# Altium schematic sheet Main.SchDoc
size A2; SheetNumber: 1; SheetTotal: 1
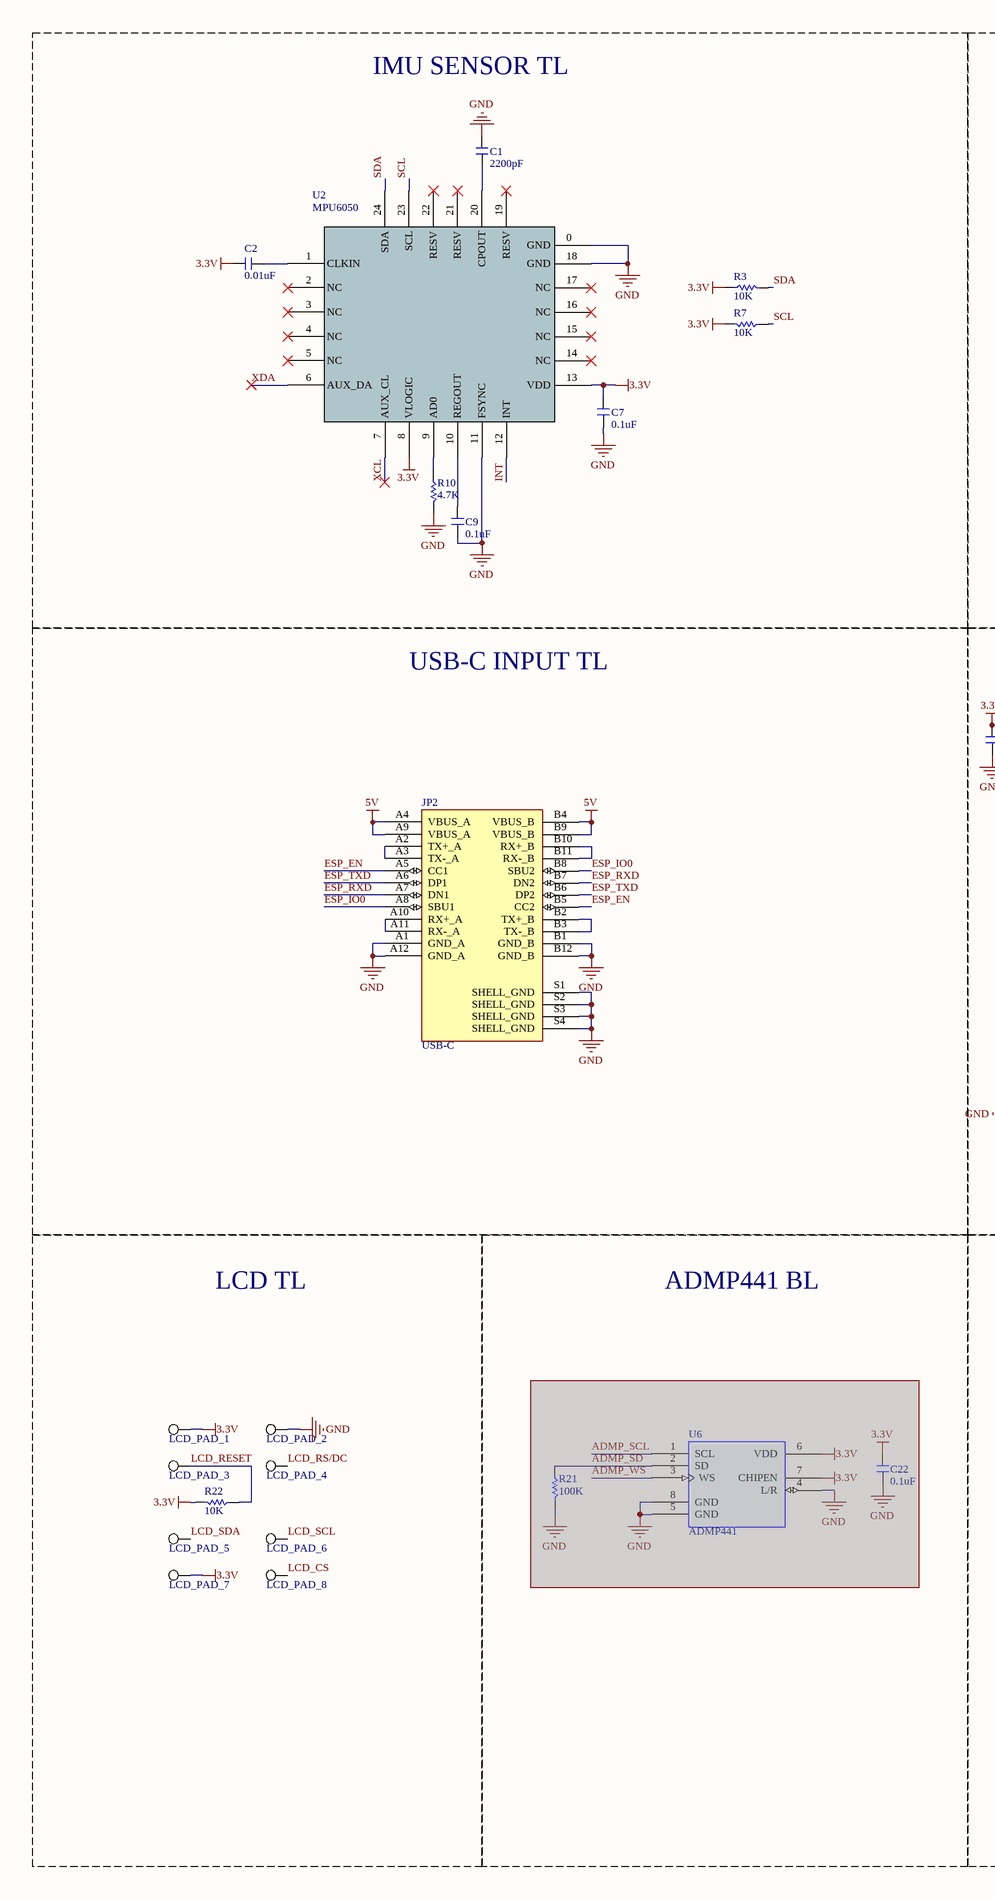
[diagram p0: Main.SchDoc, left]
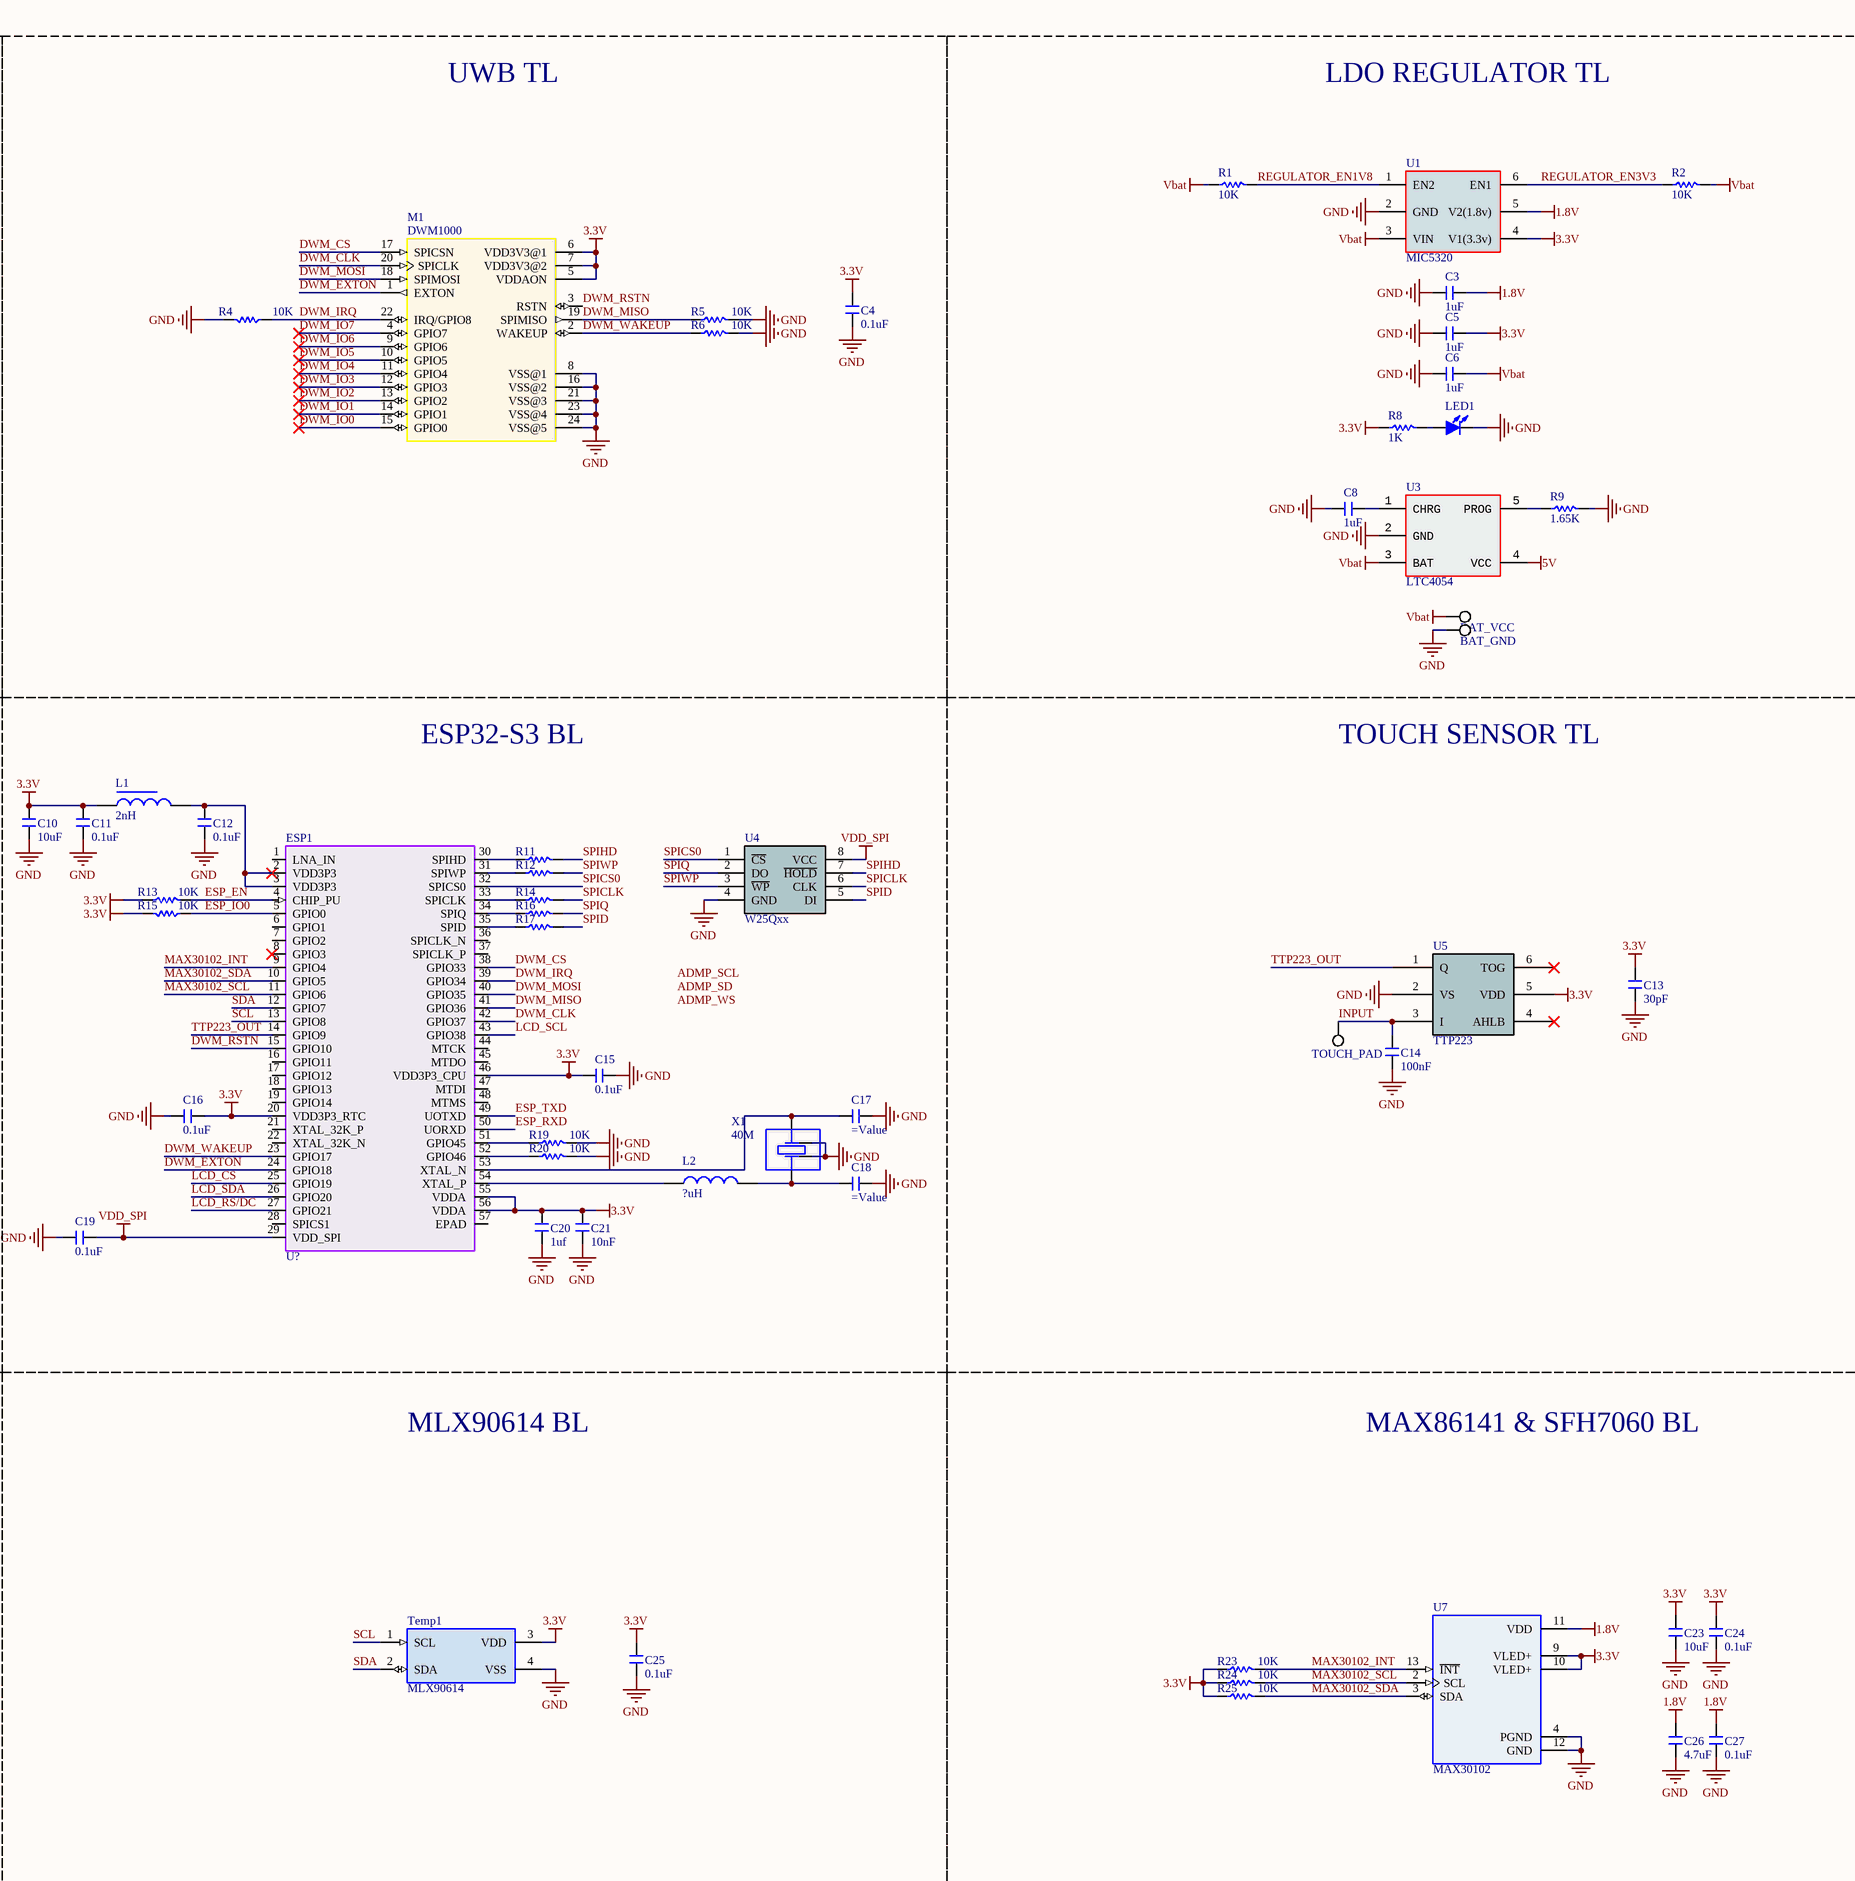
[diagram p1: Main.SchDoc, right]

## Parts
BAT_GND  Test Point Pad  [TP07SQ]  (value not drawn)
BAT_VCC  Test Point Pad  [TP07SQ]  (value not drawn)
C1  2200pF  [C 0402]
C2  0.01uF  [C 0402]
C3  1uF  [C 0603]
C4  0.1uF  [C 0402]
C5  1uF  [C 0603]
C6  1uF  [C 0603]
C7  0.1uF  [C 0402]
C8  1uF  [C 0603]
C9  0.1uF  [C 0402]
C10  10uF  [C 0805]
C11  0.1uF  [C 0402]
C12  0.1uF  [C 0402]
C13  30pF  [C 0402]
C14  100nF  [C 0402]
C15  0.1uF  [C 0402]
C16  0.1uF  [C 0402]
C17  (no value)  [C 0402]
C18  (no value)  [C 0402]
C19  0.1uF  [C 0402]
C20  1uf  [C 0402]
C21  10nF  [C 0402]
C22  0.1uF  [C 0402]  (masked out: inside a compile mask, not in the netlist)
C23  10uF  [C 0805]
C24  0.1uF  [C 0402]
C25  0.1uF  [C 0402]
C26  4.7uF  [C 0805]
C27  0.1uF  [C 0402]
ESP1  U?  [ESP32-S3 CHIP]
JP2  USB-C  [USB-C-RIGHT]
L1  2nH  [L 0603]
L2  ?uH  [L 0402]
LCD_PAD_1  Test Point Pad  [TP07SQ]  (value not drawn)
LCD_PAD_2  Test Point Pad  [TP07SQ]  (value not drawn)
LCD_PAD_3  Test Point Pad  [TP07SQ]  (value not drawn)
LCD_PAD_4  Test Point Pad  [TP07SQ]  (value not drawn)
LCD_PAD_5  Test Point Pad  [TP07SQ]  (value not drawn)
LCD_PAD_6  Test Point Pad  [TP07SQ]  (value not drawn)
LCD_PAD_7  Test Point Pad  [TP07SQ]  (value not drawn)
LCD_PAD_8  Test Point Pad  [TP07SQ]  (value not drawn)
LED1  LED-SMD  [LED 0603R]  (value not drawn)
M1  DWM1000  [DWM1000]
R1  10K  [R 0402]
R2  10K  [R 0402]
R3  10K  [R 0402]
R4  10K  [R 0402]
R5  10K  [R 0402]
R6  10K  [R 0402]
R7  10K  [R 0402]
R8  1K  [R 0402]
R9  1.65K  [R 0402]
R10  4.7K  [R 0402]
R11  0  [R 0402]  (value not drawn)
R12  0  [R 0402]  (value not drawn)
R13  10K  [R 0402]
R14  0  [R 0402]  (value not drawn)
R15  10K  [R 0402]
R16  0  [R 0402]  (value not drawn)
R17  0  [R 0402]  (value not drawn)
R19  10K  [R 0402]
R20  10K  [R 0402]
R21  100K  [R 0402]  (masked out: inside a compile mask, not in the netlist)
R22  10K  [R 0402]
R23  10K  [R 0402]
R24  10K  [R 0402]
R25  10K  [R 0402]
Temp1  MLX90614  [MLX90614]
TOUCH_PAD  Test Point Pad  [TP07SQ]  (value not drawn)
U1  MIC5320  [SOT23-6L]
U2  MPU6050  [QFN24]
U3  LTC4054  [SOT25-5L]
U4  W25Qxx  [SOP8W_N]
U5  TTP223  [SOT23-6L]
U6  ADMP441  [ADMP441]  (masked out: inside a compile mask, not in the netlist)
U7  MAX30102  [MAX30102]
X1  40M  [XTAL-3225-4]

## Nets
1.8V: C3.2 C26.1 C27.1 U1.5(V2(1.8v)) U7.11(VDD)
3.3V: C2.1 C4.2 C5.1 C7.1 C10.1 C11.1 C13.1 C15.1 C16.1 C20.1 C21.1 C23.1 C24.1 C25.1 ESP1.20(VDD3P3_RTC) ESP1.46(VDD3P3_CPU) ESP1.55(VDDA) ESP1.56(VDDA) L1.1 LCD_PAD_1.1 LCD_PAD_7.1 M1.5(VDDAON) M1.6(VDD3V3@1) M1.7(VDD3V3@2) R3.1 R7.2 R8.1 R13.1 R15.2 R22.2 R23.1 R24.1 R25.1 Temp1.3(VDD) U1.4(V1(3.3v)) U2.8(VLOGIC) U2.13(VDD) U5.5(VDD) U7.9(VLED+) U7.10(VLED+)
5V: JP2.A4(VBUS_A) JP2.A9(VBUS_A) JP2.B4(VBUS_B) JP2.B9(VBUS_B) U3.4(VCC)
GND: BAT_GND.1 C1.1 C3.1 C4.1 C5.2 C6.1 C7.2 C8.1 C9.2 C10.2 C11.2 C12.2 C13.2 C14.2 C15.2 C16.2 C17.2 C18.2 C19.2 C20.2 C21.2 C23.2 C24.2 C25.2 C26.2 C27.2 JP2.A1(GND_A) JP2.A12(GND_A) JP2.B1(GND_B) JP2.B12(GND_B) JP2.S1(SHELL_GND) JP2.S2(SHELL_GND) JP2.S3(SHELL_GND) JP2.S4(SHELL_GND) LCD_PAD_2.1 LED1.2(K) M1.8(VSS@1) M1.16(VSS@2) M1.21(VSS@3) M1.23(VSS@4) M1.24(VSS@5) R4.2 R5.2 R6.2 R9.2 R10.2 R19.2 R20.2 Temp1.4(VSS) U1.2(GND) U2.0(GND) U2.11(FSYNC) U2.18(GND) U3.2(GND) U4.4(GND) U5.2(VS) U7.4(PGND) U7.12(GND) X1.2 X1.4
Vbat: BAT_VCC.1 C6.2 R1.1 R2.2 U1.3(VIN) U3.3(BAT)
VDD_SPI: C19.1 ESP1.29(VDD_SPI) U4.8(VCC)
DWM_CLK: ESP1.42(GPIO37) M1.20(SPICLK)
DWM_CS: ESP1.38(GPIO33) M1.17(SPICSN)
DWM_EXTON: ESP1.24(GPIO18) M1.1(EXTON)
DWM_IO0: M1.15(GPIO0)
DWM_IO1: M1.14(GPIO1)
DWM_IO2: M1.13(GPIO2)
DWM_IO3: M1.12(GPIO3)
DWM_IO4: M1.11(GPIO4)
DWM_IO5: M1.10(GPIO5)
DWM_IO6: M1.9(GPIO6)
DWM_IO7: M1.4(GPIO7)
DWM_IRQ: ESP1.39(GPIO34) M1.22(IRQ/GPIO8) R4.1
DWM_MISO: ESP1.41(GPIO36) M1.19(SPIMISO) R5.1
DWM_MOSI: ESP1.40(GPIO35) M1.18(SPIMOSI)
DWM_RSTN: ESP1.15(GPIO10) M1.3(RSTN)
DWM_WAKEUP: ESP1.23(GPIO17) M1.2(WAKEUP) R6.1
ESP_EN: ESP1.4(CHIP_PU) JP2.A5(CC1) JP2.B5(CC2) R13.2
ESP_IO0: ESP1.5(GPIO0) JP2.A8(SBU1) JP2.B8(SBU2) R15.1
ESP_RXD: ESP1.50(UORXD) JP2.A7(DN1) JP2.B7(DN2)
ESP_TXD: ESP1.49(UOTXD) JP2.A6(DP1) JP2.B6(DP2)
INPUT: C14.1 TOUCH_PAD.1 U5.3(I)
INT: U2.12(INT)
LCD_CS: ESP1.25(GPIO19) LCD_PAD_8.1
LCD_RESET: LCD_PAD_3.1 R22.1
LCD_RS/DC: ESP1.27(GPIO21) LCD_PAD_4.1
LCD_SCL: ESP1.43(GPIO38) LCD_PAD_6.1
LCD_SDA: ESP1.26(GPIO20) LCD_PAD_5.1
MAX30102_INT: ESP1.9(GPIO4) R23.2 U7.13(~{INT})
MAX30102_SCL: ESP1.11(GPIO6) R24.2 U7.2(SCL)
MAX30102_SDA: ESP1.10(GPIO5) R25.2 U7.3(SDA)
REGULATOR_EN1V8: R1.2 U1.1(EN2)
REGULATOR_EN3V3: R2.1 U1.6(EN1)
SCL: ESP1.13(GPIO8) R7.1 Temp1.1(SCL) U2.23(SCL)
SDA: ESP1.12(GPIO7) R3.2 Temp1.2(SDA) U2.24(SDA)
SPICLK: R14.2 U4.6(CLK)
SPICS0: ESP1.32(SPICS0) U4.1(~{CS})
SPID: R17.2 U4.5(DI)
SPIHD: R11.2 U4.7(~{HOLD})
SPIQ: R16.2 U4.2(DO)
SPIWP: R12.2 U4.3(~{WP})
TTP223_OUT: ESP1.14(GPIO9) U5.1(Q)
XCL: U2.7(AUX_CL)
XDA: U2.6(AUX_DA)
NetC1_2: C1.2 U2.20(CPOUT)
NetC2_2: C2.2 U2.1(CLKIN)
NetC8_2: C8.2 U3.1(CHRG)
NetC9_1: C9.1 U2.10(REGOUT)
NetC12_1: C12.1 ESP1.2(VDD3P3) ESP1.3(VDD3P3) L1.2
NetC17_1: C17.1 ESP1.53(XTAL_N) X1.3
NetC18_1: C18.1 L2.2 X1.1
NetESP1_30: ESP1.30(SPIHD) R11.1
NetESP1_31: ESP1.31(SPIWP) R12.1
NetESP1_33: ESP1.33(SPICLK) R14.1
NetESP1_34: ESP1.34(SPIQ) R16.1
NetESP1_35: ESP1.35(SPID) R17.1
NetESP1_51: ESP1.51(GPIO45) R19.1
NetESP1_52: ESP1.52(GPIO46) R20.1
NetESP1_54: ESP1.54(XTAL_P) L2.1
NetJP2_A2: JP2.A2(TX+_A) JP2.A3(TX-_A)
NetJP2_A10: JP2.A10(RX+_A) JP2.A11(RX-_A)
NetJP2_B2: JP2.B2(TX+_B) JP2.B3(TX-_B)
NetJP2_B10: JP2.B10(RX+_B) JP2.B11(RX-_B)
NetLED1_1: LED1.1(A) R8.2
NetR9_1: R9.1 U3.5(PROG)
NetR10_1: R10.1 U2.9(AD0)

Not connected (* = marked no-connect by the designer): ESP1 1(LNA_IN) 6(GPIO1) 7(GPIO2) 8(GPIO3)* 16(GPIO11) 17(GPIO12) 18(GPIO13) 19(GPIO14) 21(XTAL_32K_P) 22(XTAL_32K_N) 28(SPICS1) 36(SPICLK_N) 37(SPICLK_P) 44(MTCK) 45(MTDO) 47(MTDI) 48(MTMS) 57(EPAD); U2 2(NC)* 3(NC)* 4(NC)* 5(NC)* 14(NC)* 15(NC)* 16(NC)* 17(NC)* 19(RESV)* 21(RESV)* 22(RESV)*; U5 4(AHLB)* 6(TOG)*

## Notes on the sheet
- IMU SENSOR TL
- UWB TL
- LDO REGULATOR TL
- USB-C INPUT TL
- ESP32-S3 BL
- TOUCH SENSOR TL
- LCD TL
- ADMP441 BL
- MLX90614 BL
- MAX86141 & SFH7060 BL
- Labels drawn without touching a wire or pin: ADMP_SCL, ADMP_SD, ADMP_WS

## Library data of the parts
BAT_GND BAT_VCC LCD_PAD_1-LCD_PAD_8 TOUCH_PAD = Test Point Pad: Company: SJ Libraries; Designer: Eng. Saeid Jorablo; Mounting Technology: Surface Mount\Through-Hole; ComponentLink1Description: Datasheet; Pin Count: 0; Update Date: 6/3/2012; Category: MISC; HelpURL: http://s3.picofile.com/file/7443264187/Coming_Soon_logo.gif
C1-C27 = C: Non-polar patch capacitor; BOM名称: 无极性贴片电容; 版权归属: 源创客; 学习资源: www.ooocke.com
ESP1 = ESP32-S3 CHIP
JP2 = USB-C-RIGHT
L1 L2 = L: Low power chip inductor; BOM名称: 小功率贴片电感; 版权归属: 源创客; 学习资源: www.ooocke.com
LED1 = LED-SMD: Patch LED; BOM名称: 贴片LED; 版权归属: 源创客; 学习资源: www.ooocke.com
R1-R17 R19-R25 = R: Chip resistor; 版权归属: 源创客; BOM名称: Chip resistor; 学习资源: www.ooocke.com
Temp1 = MLX90614: Temperature Sensor Digital, Infrared (IR) -40°C ~ 85°C 16 b TO-39; Auther: AmirHosein Yousefi
U2 = MPU6050: Six-axis accelerometer
U3 = LTC4054: Battery Charger; Type: SOT23-5
U4 = W25Qxx: External flash; BOM名称: 外置Flash; 版权归属: 源创客; 学习资源: www.ooocke.com
X1 = XTAL-4: 4-Pin crystal; BOM名称: 4脚晶振; 版权归属: 源创客; 学习资源: www.ooocke.com